# EAGLE schematic haptichandpcb (EAGLE 9.6.2)
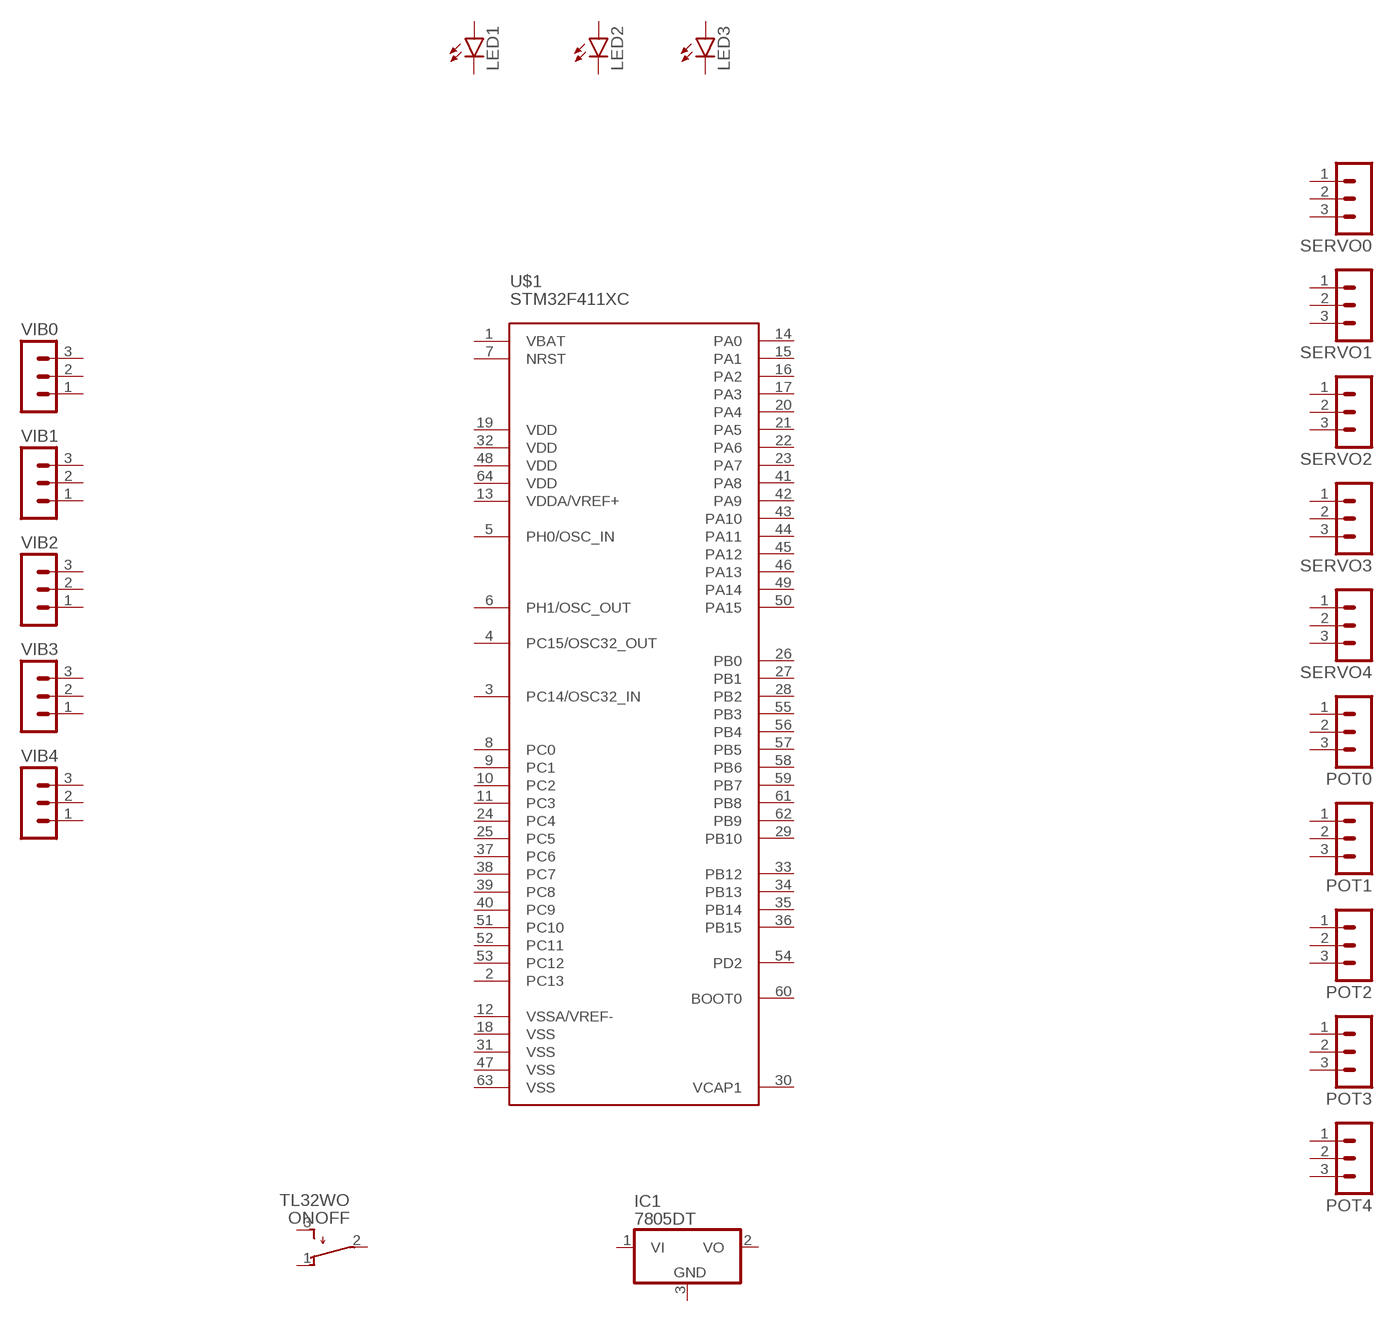
[diagram p0: schematic, sheet 1]

## Parts
IC1  7805DT  [TO252]
LED1  LED5MM  [LED5MM]
LED2  LED5MM  [LED5MM]
LED3  LED5MM  [LED5MM]
ONOFF  TL32WO  [TL3XWO]
POT0  MA03-1  [MA03-1]
POT1  MA03-1  [MA03-1]
POT2  MA03-1  [MA03-1]
POT3  MA03-1  [MA03-1]
POT4  MA03-1  [MA03-1]
SERVO0  MA03-1  [MA03-1]
SERVO1  MA03-1  [MA03-1]
SERVO2  MA03-1  [MA03-1]
SERVO3  MA03-1  [MA03-1]
SERVO4  MA03-1  [MA03-1]
U$1  STM32F411XC  [LQFP64]
VIB0  MA03-1  [MA03-1]
VIB1  MA03-1  [MA03-1]
VIB2  MA03-1  [MA03-1]
VIB3  MA03-1  [MA03-1]
VIB4  MA03-1  [MA03-1]
Unconnected: IC1.1(VI) IC1.2(VO) IC1.3(GND) LED1.A LED1.K(C) LED2.A LED2.K(C) LED3.A LED3.K(C) ONOFF.1(O) ONOFF.2(P) ONOFF.3(S) POT0.1 POT0.2 POT0.3 POT1.1 POT1.2 POT1.3 POT2.1 POT2.2 POT2.3 POT3.1 POT3.2 POT3.3 POT4.1 POT4.2 POT4.3 SERVO0.1 SERVO0.2 SERVO0.3 SERVO1.1 SERVO1.2 SERVO1.3 SERVO2.1 SERVO2.2 SERVO2.3 SERVO3.1 SERVO3.2 SERVO3.3 SERVO4.1 SERVO4.2 SERVO4.3 U$1.1(VBAT) U$1.2(PC13) U$1.3(PC14/OSC32_IN) U$1.4(PC15/OSC32_OUT) U$1.5(PH0/OSC_IN) U$1.6(PH1/OSC_OUT) U$1.7(NRST) U$1.8(PC0) U$1.9(PC1) U$1.10(PC2) U$1.11(PC3) U$1.12(VSSA/VREF-) U$1.13(VDDA/VREF+) U$1.14(PA0) U$1.15(PA1) U$1.16(PA2) U$1.17(PA3) U$1.18(VSS) U$1.19(VDD) U$1.20(PA4) U$1.21(PA5) U$1.22(PA6) U$1.23(PA7) U$1.24(PC4) U$1.25(PC5) U$1.26(PB0) U$1.27(PB1) U$1.28(PB2) U$1.29(PB10) U$1.30(VCAP1) U$1.31(VSS) U$1.32(VDD) U$1.33(PB12) U$1.34(PB13) U$1.35(PB14) U$1.36(PB15) U$1.37(PC6) U$1.38(PC7) U$1.39(PC8) U$1.40(PC9) U$1.41(PA8) U$1.42(PA9) U$1.43(PA10) U$1.44(PA11) U$1.45(PA12) U$1.46(PA13) U$1.47(VSS) U$1.48(VDD) U$1.49(PA14) U$1.50(PA15) U$1.51(PC10) U$1.52(PC11) U$1.53(PC12) U$1.54(PD2) U$1.55(PB3) U$1.56(PB4) U$1.57(PB5) U$1.58(PB6) U$1.59(PB7) U$1.60(BOOT0) U$1.61(PB8) U$1.62(PB9) U$1.63(VSS) U$1.64(VDD) VIB0.1 VIB0.2 VIB0.3 VIB1.1 VIB1.2 VIB1.3 VIB2.1 VIB2.2 VIB2.3 VIB3.1 VIB3.2 VIB3.3 VIB4.1 VIB4.2 VIB4.3

## Library data of the parts
IC1 = linear:78*: Positive VOLTAGE REGULATOR Source: http://cache.national.com/ds/LM/LM78L05.pdf http://www.fairchildsemi.com/ds/LM/LM7805.pdf
LED1-LED3 = led:LED: LED OSRAM: - CHIPLED LG R971, LG N971, LY N971, LG Q971, LY Q971, LO R971, LY R971 LH N974, LH R974 LS Q976, LO Q976, LY Q976 LO Q996 - Hyper CHIPLED LW Q18S LB Q993, LB Q99A, LB R99A - SideLED LS A670, LO A670, LY A670, LG A670, LP A670 LB A673, LV A673, LT A673, LW A673 LH A674 LY A675 LS A676, LA A676, LO A676, LY A676, LW A676 LS A679, LY A679, LG A679 - Hyper Micro SIDELED® LS Y876, LA Y876, LO Y876, LY Y876 LT Y87S - SmartLED LW L88C, LW L88S LB L89C, LB L89S, LG L890 LS L89K, LO L89K, LY L89K LS L896, LA L896, LO L896, LY L896 - TOPLED LS T670, LO T670, LY T670, LG T670, LP T670 LSG T670, LSP T670, LSY T670, LOP T670, LYG T670 LG T671, LOG T671, LSG T671 LB T673, LV T673, LT T673, LW T673 LH T674 LS T676, LA T676, LO T676, LY T676, LB T676, LH T676, LSB T676, LW T676 LB T67C, LV T67C, LT T67C, LS T67K, LO T67K, LY T67K, LW E67C LS E67B, LA E67B, LO E67B, LY E67B, LB E67C, LV E67C, LT E67C LW T67C LS T679, LY T679, LG T679 LS T770, LO T770, LY T770, LG T770, LP T770 LB T773, LV T773, LT T773, LW T773 LH T774 LS E675, LA E675, LY E675, LS T675 LS T776, LA T776, LO T776, LY T776, LB T776 LHGB T686 LT T68C, LB T68C - Hyper Mini TOPLED® LB M676 - Mini TOPLED Santana® LG M470 LS M47K, LO M47K, LY M47K Source: http://www.osram.convergy.de LUXEON: - LUMILED® LXK2-PW12-R00, LXK2-PW12-S00, LXK2-PW14-U00, LXK2-PW14-V00 LXK2-PM12-R00, LXK2-PM12-S00, LXK2-PM14-U00 LXK2-PE12-Q00, LXK2-PE12-R00, LXK2-PE12-S00, LXK2-PE14-T00, LXK2-PE14-U00 LXK2-PB12-K00, LXK2-PB12-L00, LXK2-PB12-M00, LXK2-PB14-N00, LXK2-PB14-P00, LXK2-PB14-Q00 LXK2-PR12-L00, LXK2-PR12-M00, LXK2-PR14-Q00, LXK2-PR14-R00 LXK2-PD12-Q00, LXK2-PD12-R00, LXK2-PD12-S00 LXK2-PH12-R00, LXK2-PH12-S00 LXK2-PL12-P00, LXK2-PL12-Q00, LXK2-PL12-R00 Source: www.luxeon.com KINGBRIGHT: KA-3528ASYC Source: www.kingbright.com
ONOFF = switch:TL32WO: TINY SWITCH ON - MOM Source: http://www2.produktinfo.conrad.com/datenblaetter/700000-724999/705152-da-01-de-Subminiaturschalter_TL_36WO.pdf
POT0 POT1-POT4 SERVO0 SERVO1-SERVO4 VIB0 VIB1-VIB4 = con-lstb:MA03-1: PIN HEADER; OC_FARNELL: unknown; OC_NEWARK: unknown
U$1 = stm32f411ret6:STM32F411XC